# Altium project NFC.PrjPcb
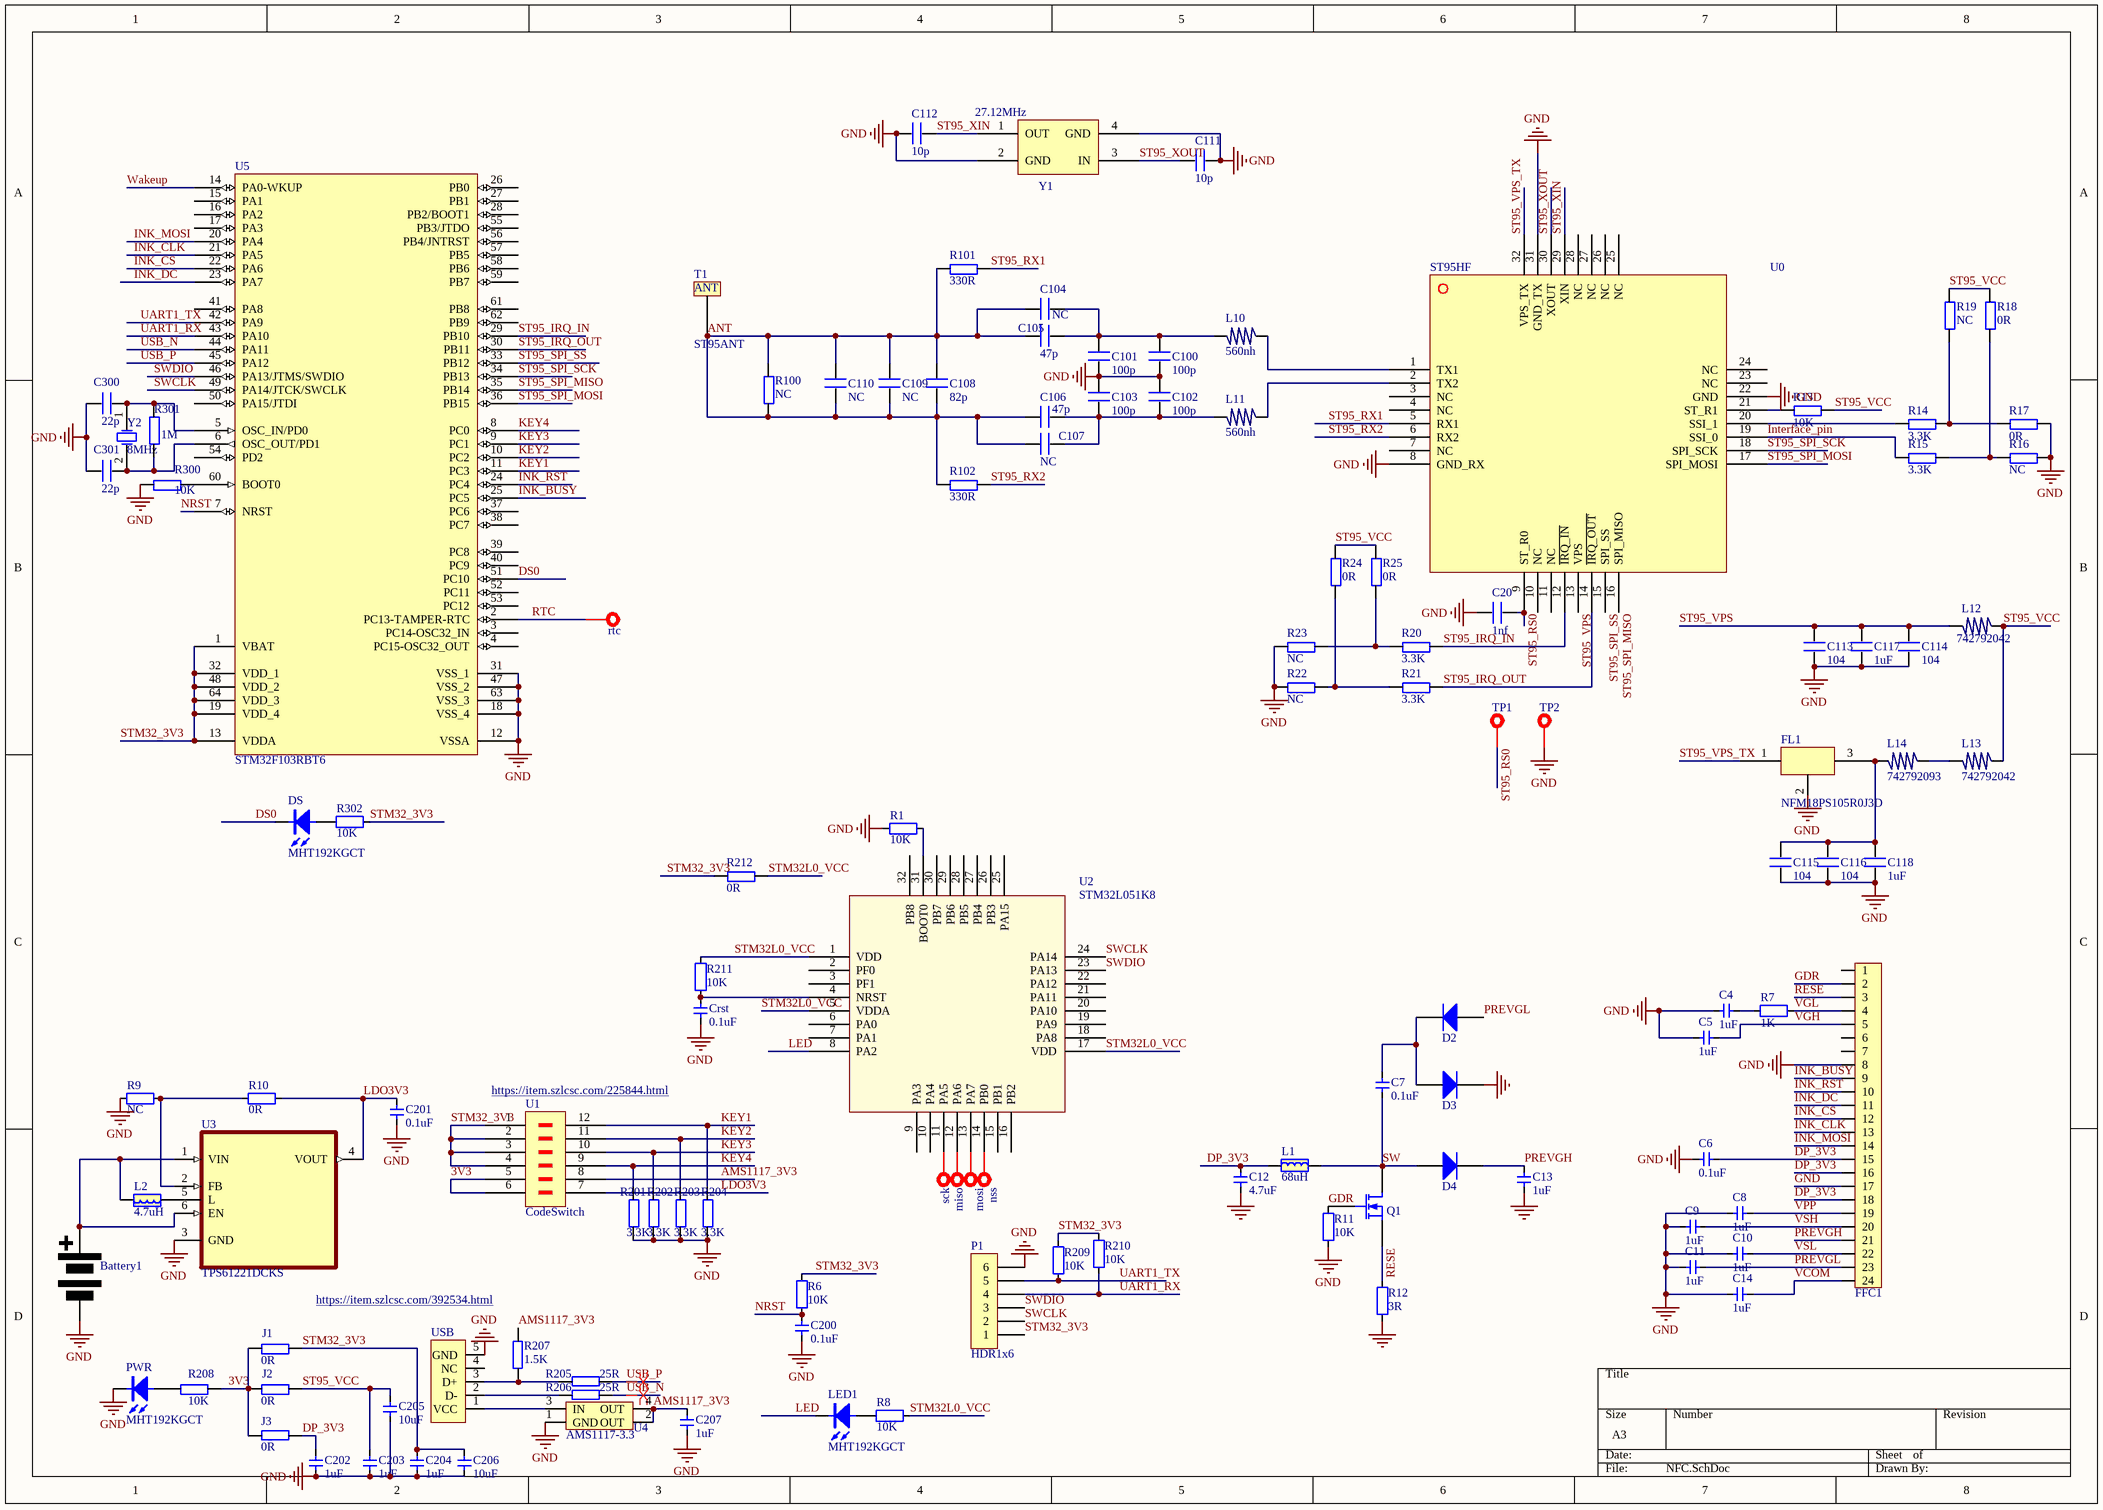
[diagram p0: NFC.SchDoc]
1 sheet, 119 parts. Net scope: global (net labels, ports and power ports of the same name join across sheets).
Board file: NFC.PcbDoc

## Sheet NFC.SchDoc
size A3

### Parts
Battery1  Battery  [CR2032-1]  (value not drawn)
C4  1uF  [0402cap]
C5  1uF  [0402cap]
C6  0.1uF  [0402cap]
C7  0.1uF  [0402cap]
C8  1uF  [0402cap]
C9  1uF  [0402cap]
C10  1uF  [0402cap]
C11  1uF  [0402cap]
C12  4.7uF  [0402cap]
C13  1uF  [0402cap]
C14  1uF  [0402cap]
C20  1nf  [0402cap]
C100  100p  [0603P]
C101  100p  [0603P]
C102  100p  [0603P]
C103  100p  [0603P]
C104  NC  [0603P]
C105  47p  [0603P]
C106  47p  [0603P]
C107  NC  [0603P]
C108  82p  [0603P]
C109  NC  [0603P]
C110  NC  [0603P]
C111  10p  [0402cap]
C112  10p  [0402cap]
C113  104  [0402cap]
C114  104  [0402cap]
C115  104  [0402cap]
C116  104  [0402cap]
C117  1uF  [0402cap]
C118  1uF  [0402cap]
C200  0.1uF  [0402cap]
C201  0.1uF  [0402cap]
C202  1uF  [0402cap]
C203  1uF  [0402cap]
C204  1uF  [0402cap]
C205  10uF  [0603p]
C206  10uF  [0603p]
C207  1uF  [0402cap]
C300  22p  [0402cap]
C301  22p  [0402cap]
Crst  0.1uF  [0402cap]
D2  二极管-5819W  [SOD-123]  (value not drawn)
D3  二极管-5819W  [SOD-123]  (value not drawn)
D4  二极管-5819W  [SOD-123]  (value not drawn)
DS  MHT192KGCT  [LED-0603]
FFC1  FFC_0.5_24  [FFC_0.5_24_INK]  (value not drawn)
FL1  NFM18PS105R0J3D  [NFM18PS]
J1  0R  [res0402]
J2  0R  [res0402]
J3  0R  [res0402]
L1  68uH  [2520-L]
L2  4.7uH  [0805-L]
L10  560nh  [0805]
L11  560nh  [0805]
L12  742792042  [0805]
L13  742792042  [0805]
L14  742792093  [0805]
LED1  MHT192KGCT  [LED-0603]
miso  TestPoint  [TestPoint]  (value not drawn)
mosi  TestPoint  [TestPoint]  (value not drawn)
nss  TestPoint  [TestPoint]  (value not drawn)
P1  HDR1x6  [PIN-6-2.54-1.0]
PWR  MHT192KGCT  [LED-0603]
Q1  MOSFET-N  [SOT23-3]  (value not drawn)
R1  10K  [res0402]
R6  10K  [res0402]
R7  1K  [res0402]
R8  10K  [res0402]
R9  NC  [res0402]
R10  0R  [res0402]
R11  10K  [res0402]
R12  3R  [res0402]
R13  10K  [res0402]
R14  3.3K  [res0402]
R15  3.3K  [res0402]
R16  NC  [res0402]
R17  0R  [res0402]
R18  0R  [res0402]
R19  NC  [res0402]
R20  3.3K  [res0402]
R21  3.3K  [res0402]
R22  NC  [res0402]
R23  NC  [res0402]
R24  0R  [res0402]
R25  0R  [res0402]
R100  NC  [0603R]
R101  330R  [0603R]
R102  330R  [0603R]
R201  3.3K  [res0402]
R202  3.3K  [res0402]
R203  3.3K  [res0402]
R204  3.3K  [res0402]
R205  25R  [res0402]
R206  25R  [res0402]
R207  1.5K  [res0402]
R208  10K  [res0402]
R209  10K  [res0402]
R210  10K  [res0402]
R211  10K  [res0402]
R212  0R  [res0402]
R300  10K  [res0402]
R301  1M  [res0402]
R302  10K  [res0402]
rtc  TestPoint  [TestPoint]  (value not drawn)
sck  TestPoint  [TestPoint]  (value not drawn)
T1  ST95ANT  [ST95ANT]
TP1  TestPoint  [TestPoint]  (value not drawn)
TP2  TestPoint  [TestPoint]  (value not drawn)
U0  ST95HF-VMD5T  [VFQFPN-32]  (value not drawn)
U1  CodeSwitch  [SOP12]
U2  STM32L051K8  [QFN-32]
U3  TPS61221DCKS  [SOT65P210X110-6N]
U4  AMS1117-3.3  [SOT-223]
U5  STM32F103RBT6  [LQFP64_N]
USB  USB  [MICRO-USB]  (value not drawn)
Y1  27.12MHz  [SMD-2016_4P]
Y2  8MHz  [XTAL_US]

### Nets
GND: Battery1.1(-) C4.1 C5.1 C6.1 C8.1 C9.1 C10.1 C11.1 C12.2 C13.2 C14.1 C20.2 C100.1 C101.1 C102.2 C103.2 C111.2 C112.1 C113.2 C114.2 C115.1 C116.1 C117.1 C118.1 C200.2 C201.2 C202.2 C203.2 C204.2 C205.2 C206.2 C207.2 C300.1 C301.1 Crst.2 D3.2(K) FFC1.8 FFC1.17 FL1.2 P1.6 PWR.2(C) R1.2 R9.2 R11.1 R12.1 R16.2 R17.2 R22.1 R23.1 R201.1 R202.1 R203.1 R204.1 R300.1 TP2.1(TP) U0.8(GND_RX) U0.22(GND) U0.31(GND_TX) U3.3(GND) U4.1(GND) U5.12(VSSA) U5.18(VSS_4) U5.31(VSS_1) U5.47(VSS_2) U5.63(VSS_3) USB.5(GND) Y1.2(GND) Y1.4(GND)
3V3: J1.1 J2.1 J3.2 R208.2 U1.5 U1.6
AMS1117_3V3: C207.1 R207.1 U1.8 U4.2(OUT) U4.4(OUT)
ANT: C104.1 C105.1 C106.1 C107.1 C108.1 C108.2 C109.1 C109.2 C110.1 C110.2 R100.1 R100.2 R101.1 R102.1 T1.1(ANT)
DP_3V3: C6.2 C12.1 C202.1 FFC1.15 FFC1.16 FFC1.18 J3.1 L1.1
DS0: DS.2(C) U5.51(PC10)
GDR: FFC1.2 Q1.1(G) R11.2
INK_BUSY: FFC1.9 U5.25(PC5)
INK_CLK: FFC1.13 U5.21(PA5)
INK_CS: FFC1.12 U5.22(PA6)
INK_DC: FFC1.11 U5.23(PA7)
INK_MOSI: FFC1.14 U5.20(PA4)
INK_RST: FFC1.10 U5.24(PC4)
Interface_pin: R15.1 U0.19(SSI_0)
KEY1: R204.2 U1.12 U5.11(PC3)
KEY2: R203.2 U1.11 U5.10(PC2)
KEY3: R202.2 U1.10 U5.9(PC1)
KEY4: R201.2 U1.9 U5.8(PC0)
LDO3V3: C201.1 R10.1 U1.7 U3.4(VOUT)
LED: LED1.2(C) U2.8(PA2)
NRST: C200.1 R6.1 U5.7(NRST)
PREVGH: C13.1 D4.2(K) FFC1.21
PREVGL: C11.2 D2.1(A) FFC1.23
RESE: FFC1.3 Q1.2(S) R12.2
RTC: rtc.1(TP) U5.2(PC13-TAMPER-RTC)
ST95_IRQ_IN: R20.2 U0.12(~{IRQ_IN}) U5.29(PB10)
ST95_IRQ_OUT: R21.2 U0.14(~{IRQ_OUT}) U5.30(PB11)
ST95_RS0: C20.1 TP1.1(TP) U0.9(ST_R0)
ST95_RX1: R101.2 U0.5(RX1)
ST95_RX2: R102.2 U0.6(RX2)
ST95_SPI_MISO: U0.16(SPI_MISO) U5.35(PB14)
ST95_SPI_MOSI: U0.17(SPI_MOSI) U5.36(PB15)
ST95_SPI_SCK: U0.18(SPI_SCK) U5.34(PB13)
ST95_SPI_SS: U0.15(SPI_SS) U5.33(PB12)
ST95_VCC: C203.1 C205.1 J2.2 L12.1 L13.1 R13.2 R18.2 R19.2 R24.2 R25.2
ST95_VPS: C113.1 C114.1 C117.2 L12.2 U0.13(VPS)
ST95_VPS_TX: FL1.1 U0.32(VPS_TX)
ST95_XIN: C112.2 U0.29(XIN) Y1.1(OUT)
ST95_XOUT: C111.1 U0.30(XOUT) Y1.3(IN)
STM32_3V3: C204.1 C206.1 J1.2 P1.1 R6.2 R209.2 R210.2 R212.1 R302.2 U1.1 U1.2 U1.3 U1.4 U5.1(VBAT) U5.13(VDDA) U5.19(VDD_4) U5.32(VDD_1) U5.48(VDD_2) U5.64(VDD_3)
STM32L0_VCC: R8.2 R211.2 R212.2 U2.1(VDD) U2.5(VDDA) U2.17(VDD)
SW: C7.2 D4.1(A) L1.2 Q1.3(D)
SWCLK: P1.2 U2.24(PA14) U5.49(PA14/JTCK/SWCLK)
SWDIO: P1.3 U2.23(PA13) U5.46(PA13/JTMS/SWDIO)
UART1_RX: P1.4 R210.1 U5.43(PA10)
UART1_TX: P1.5 R209.1 U5.42(PA9)
USB_N: R206.1 U5.44(PA11)
USB_P: R205.1 U5.45(PA12)
VCOM: C14.2 FFC1.24
VGH: C5.2 FFC1.5
VGL: FFC1.4 R7.1
VPP: C8.2 FFC1.19
VSH: C9.2 FFC1.20
VSL: C10.2 FFC1.22
Wakeup: U5.14(PA0-WKUP)
NetBattery1_2: Battery1.2(+) L2.2 U3.1(VIN) U3.6(EN)
NetC4_2: C4.2 R7.2
NetC7_1: C7.1 D2.2(K) D3.1(A)
NetC100_2: C100.2 C101.2 C104.2 C105.2 L10.2
NetC102_1: C102.1 C103.1 C106.2 C107.2 L11.2
NetC115_2: C115.2 C116.2 C118.2 FL1.3 L14.2
NetC300_2: C300.2 R301.2 U5.5(OSC_IN/PD0) Y2.1(OSC1)
NetC301_2: C301.2 R301.1 U5.6(OSC_OUT/PD1) Y2.2(OSC2)
NetCrst_1: Crst.1 R211.1 U2.4(NRST)
NetDS_1: DS.1(A) R302.1
NetL2_1: L2.1 U3.5(L)
NetL10_1: L10.1 U0.1(TX1)
NetL11_1: L11.1 U0.2(TX2)
NetL13_2: L13.2 L14.1
NetLED1_1: LED1.1(A) R8.1
Netmiso_1: miso.1(TP) U2.12(PA6)
Netmosi_1: mosi.1(TP) U2.13(PA7)
Netnss_1: nss.1(TP) U2.14(PB0)
NetPWR_1: PWR.1(A) R208.1
NetR1_1: R1.1 U2.31(BOOT0)
NetR9_1: R9.1 R10.2 U3.2(FB)
NetR13_1: R13.1 U0.21(ST_R1)
NetR14_1: R14.1 U0.20(SSI_1)
NetR14_2: R14.2 R17.1 R19.1
NetR15_2: R15.2 R16.1 R18.1
NetR20_1: R20.1 R23.2 R25.1
NetR21_1: R21.1 R22.2 R24.1
NetR205_2: R205.2 R207.2 USB.3(D+)
NetR206_2: R206.2 USB.2(D-)
NetR300_2: R300.2 U5.60(BOOT0)
Netsck_1: sck.1(TP) U2.11(PA5)
NetU4_3: U4.3(IN) USB.1(VCC)

Not connected (* = marked no-connect by the designer): FFC1 1 6 7; U0 3(NC) 4(NC) 7(NC) 10(NC) 11(NC) 23(NC) 24(NC) 25(NC) 26(NC) 27(NC) 28(NC); U2 2(PF0) 3(PF1) 6(PA0) 7(PA1) 9(PA3) 10(PA4) 15(PB1) 16(PB2) 18(PA8) 19(PA9) 20(PA10) 21(PA11) 22(PA12) 25(PA15) 26(PB3) 27(PB4) 28(PB5) 29(PB6) 30(PB7) 32(PB8); U5 3(PC14-OSC32_IN) 4(PC15-OSC32_OUT) 15(PA1) 16(PA2) 17(PA3) 26(PB0) 27(PB1) 28(PB2/BOOT1) 37(PC6) 38(PC7) 39(PC8) 40(PC9) 41(PA8) 50(PA15/JTDI) 52(PC11) 53(PC12) 54(PD2) 55(PB3/JTDO) 56(PB4/JNTRST) 57(PB5) 58(PB6) 59(PB7) 61(PB8) 62(PB9); USB 4(NC)

### Layout directives
differential pair: USB_N, USB_P

### Notes on the sheet
- (near U1) https://item.szlcsc.com/225844.html
- https://item.szlcsc.com/392534.html

### Library data of the parts
C4-C11 C13 C14 C200-C207 Crst = 电容-0402: Capacitor; Value: 0.1u
C12 = 电容-0603: Capacitor; Value: 0.1u
C20 C100-C118 C300 C301 = C
D2-D4 = 二极管-5819W: 40V
DS LED1 PWR = LED
FFC1 = FFC_0.5_24_INK: FFC
FL1 = NFM18PS
J1-J3 R13-R25 R100-R102 R201-R208 R212 R300 R301 = R
L1 = 电感-2520: 磁珠
L2 = 电感-0805: 磁珠
L10-L14 = L
P1 = HDR1x6: Connector
Q1 = MOSFET-N: N-Channel MOSFET; Published: 8-Jun-2000; LatestRevisionDate: 17-Jul-2002; LatestRevisionNote: Re-released for DXP Platform.; PackageVersion: 1995/1996; PackageReference: E3; Publisher: Altium Limited; PackageDescription: TO, Flat Index; 3 In-Line, Axial Leads; Body Dia. 4.6mm; Lead Dia. 0.5 mm (max)
R1 R6-R12 R209-R211 R302 = 电阻-0402: Resistor; Value: 22R
U0 = ST95HF
U3 = TPS61221DCKT: Boost Switching Regulator IC Positive Fixed 3.3V 1 Output 200mA _Switch_ 6-TSSOP, SC-88, SOT-363; MF: Texas Instruments; MP: TPS61221DCK; Price: None; SnapEDA_Link: https://www.snapeda.com/parts/TPS61221DCK/Texas%20Instruments/view-part/2767825/?ref=snap; Availability: Unavailable; Value: *; Package: SOT-363 Texas Instruments
U4 = AMS1117
U5 = STM32F103RBT6: STM32 ARM-based 32-bit MCU with 128 Kbytes Flash, 64-pin LQFP, Industrial Temperature; Published: *; DatasheetVersion: *; PackageVersion: *; PackageReference: *; Publisher: *; PackageDescription: *; ComponentLink1Description: *; ComponentLink1URL: *; ComponentLink2Description: *; ComponentLink2URL: *
USB = USB5
Y1 = NX2016
Y2 = XTAL: Crystal Oscillator; Published: 8-Jun-2000; LatestRevisionDate: 17-Jul-2002; LatestRevisionNote: Re-released for DXP Platform.; Publisher: Altium Limited